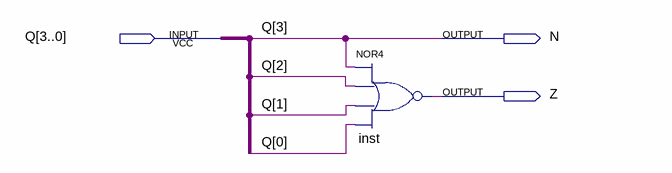
[diagram p0: schematic sheet]
// Quartus schematic Flags.bdf as structural Verilog: 1 symbols, 3 pins
module Flags (
  input  [3:0] Q,
  output N,
  output Z
);

  nor inst (Z, Q[3], Q[2], Q[1], Q[0]);

  assign N = Q[3];
endmodule
